# EAGLE design Regulated 4A Adjustable Circuit (EAGLE 9.6.2)
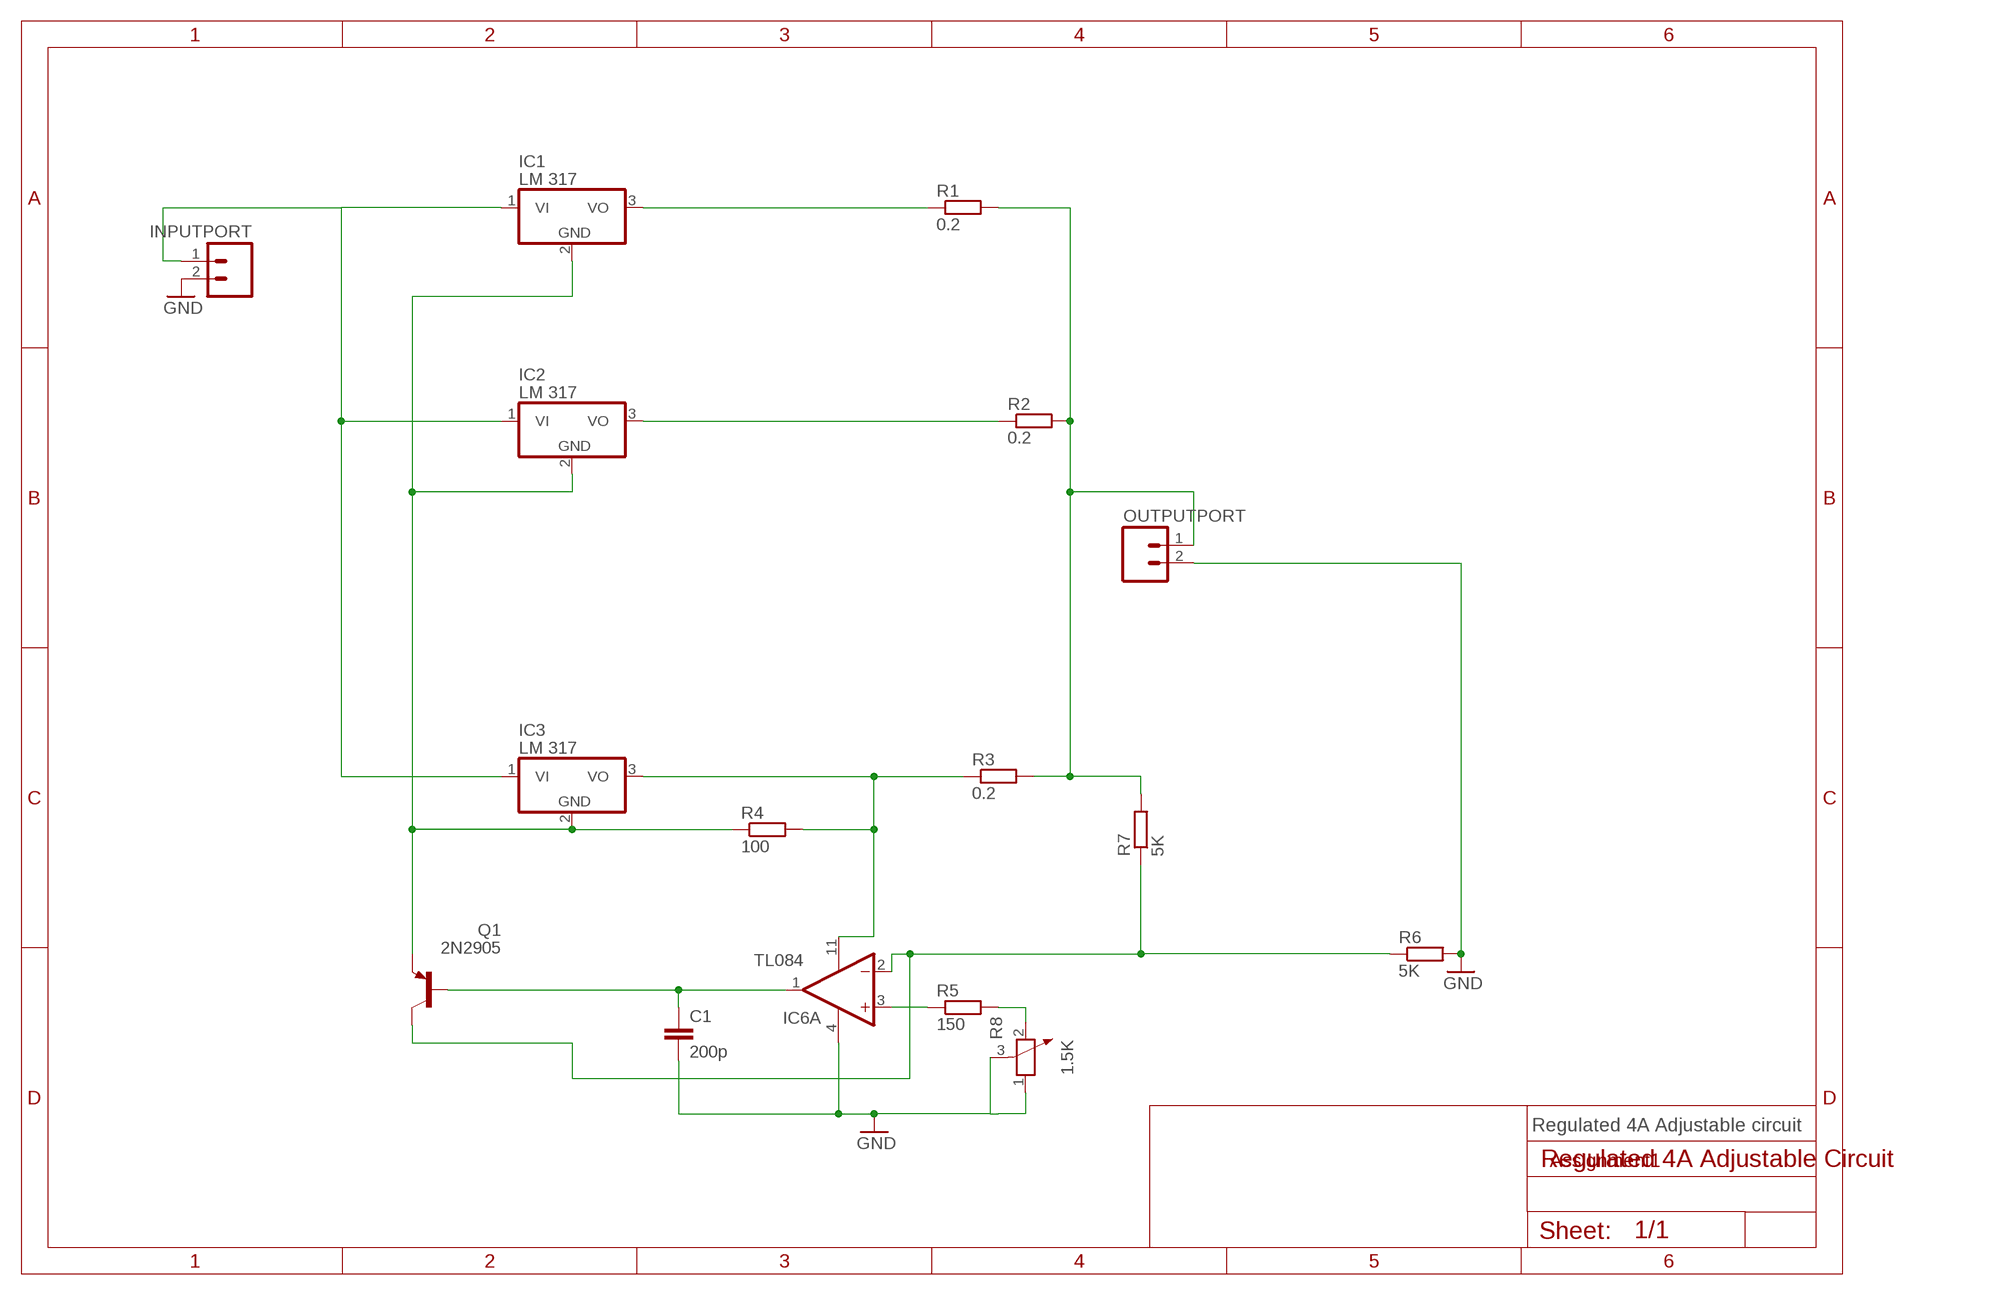
[diagram p0: schematic, sheet 1]

## Parts
C1  200p  C-EU025-025X050  [C025-025X050]
IC1  LM 317  7805TV  [TO220V]
IC2  LM 317  7805TV  [TO220V]
IC3  LM 317  7805TV  [TO220V]
IC6  TL084  MCP604P  [DIL14]
Q1  2N2905  [TO39]
R1  0.2  R-EU_0207/10  [0207/10]
R2  0.2  R-EU_0207/10  [0207/10]
R3  0.2  R-EU_0207/10  [0207/10]
R4  100  R-EU_0207/10  [0207/10]
R5  150  R-EU_0207/10  [0207/10]
R6  5K  R-EU_0207/10  [0207/10]
R7  5K  R-EU_0207/10  [0207/10]
R8  1.5K  POTENTIOMETER_PT-10  [PT-10]
SL1  INPUTPORT  M02  [02P]
SL2  OUTPUTPORT  M02  [02P]

## Nets
GND: C1.2 IC6.4(P:V+) R6.2 R8.1 R8.3 SL1.2 SL2.2
N$1: IC1.3(VO) R1.1
N$2: IC2.3(VO) R2.1
N$3: IC3.3(VO) IC6.11(P:V-) R3.1 R4.2
N$4: R1.2 R2.2 R3.2 R7.2 SL2.1
N$5: IC6.3(A:+IN) R5.1
N$6: IC6.2(A:-IN) Q1.3(C) R6.1 R7.1
N$7: R5.2 R8.2
N$8: IC1.2(GND) IC2.2(GND) IC3.2(GND) Q1.1(E) R4.1
N$9: IC1.1(VI) IC2.1(VI) IC3.1(VI) SL1.1
N$11: C1.1 IC6.1(A:OUT) Q1.2(B)
Unconnected: IC6.5(B:+IN) IC6.6(B:-IN) IC6.7(B:OUT) IC6.8(C:OUT) IC6.9(C:-IN) IC6.10(C:+IN) IC6.12(D:+IN) IC6.13(D:-IN) IC6.14(D:OUT)

## Notes on the sheet
- Regulated 4A Adjustable circuit
- Assignment1

## Library data of the parts
C1 = rcl:C-EU: CAPACITOR, European symbol; SPICEPREFIX: C
IC1-IC3 = linear:78*: Positive VOLTAGE REGULATOR Source: http://cache.national.com/ds/LM/LM78L05.pdf http://www.fairchildsemi.com/ds/LM/LM7805.pdf
IC6 = linear:MCP604: Quad Op Amp 2.7V to 6.0V Single Supply CMOS Source: http://ww1.microchip.com/downloads/en/DeviceDoc/21314g.pdf
Q1 = transistor-pnp:2N2905*: PNP Transistror
R1-R7 = rcl:R-EU_: RESISTOR, European symbol; SPICEPREFIX: R
R8 = rcl:POTENTIOMETER_: Potentiometer; SPICEMODEL: POT; SPICEPREFIX: X
SL1 SL2 = con-amp-quick:M02: AMP QUICK CONNECTOR; OC_FARNELL: unknown; OC_NEWARK: unknown

## Board
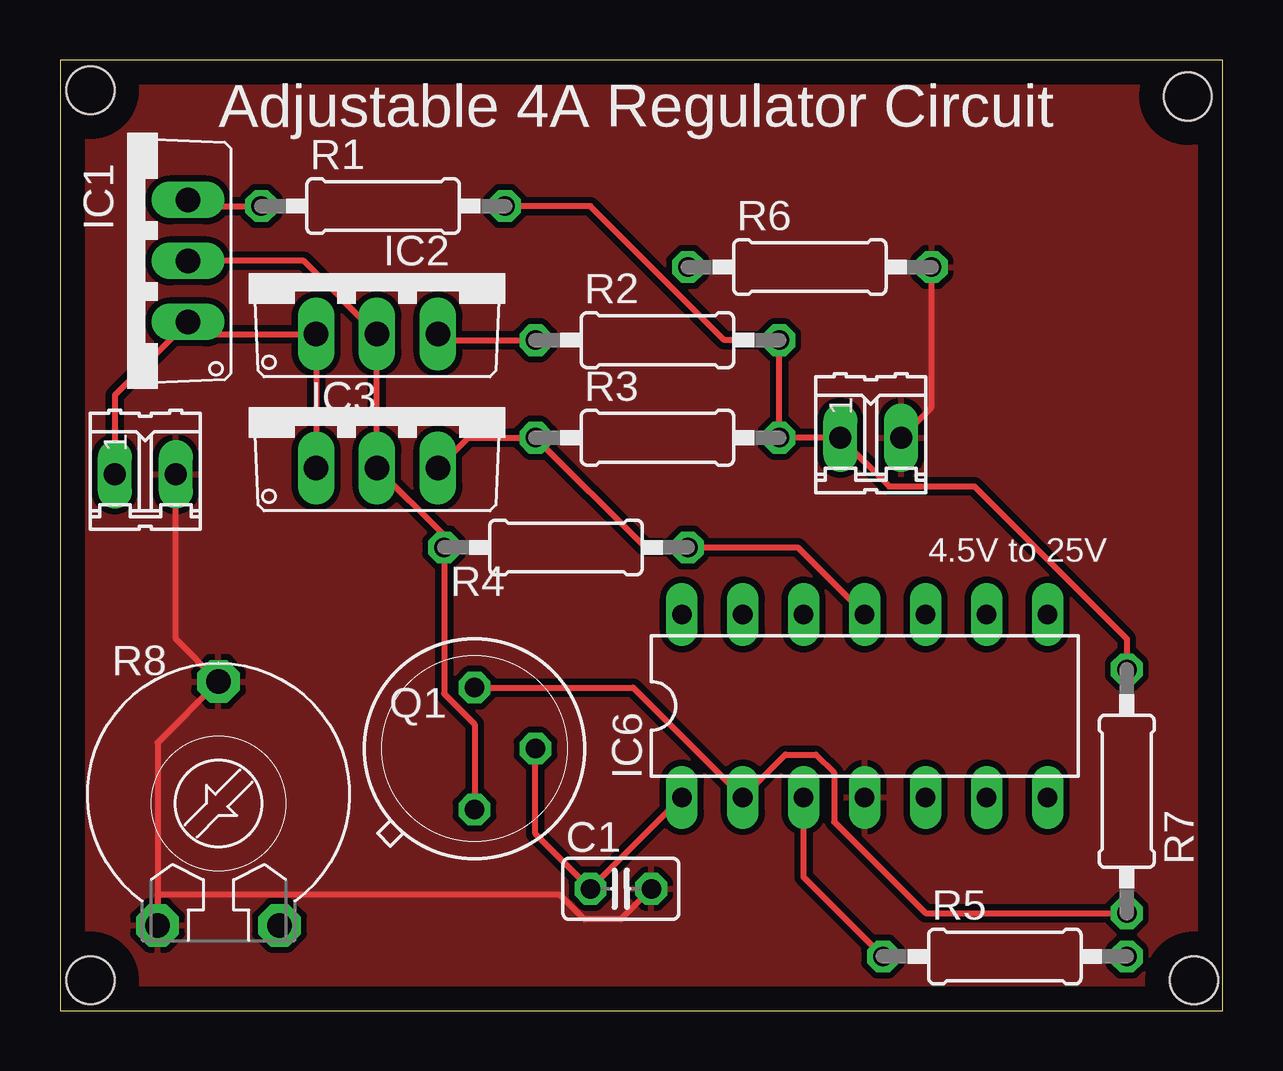
[diagram p1: board, top side]
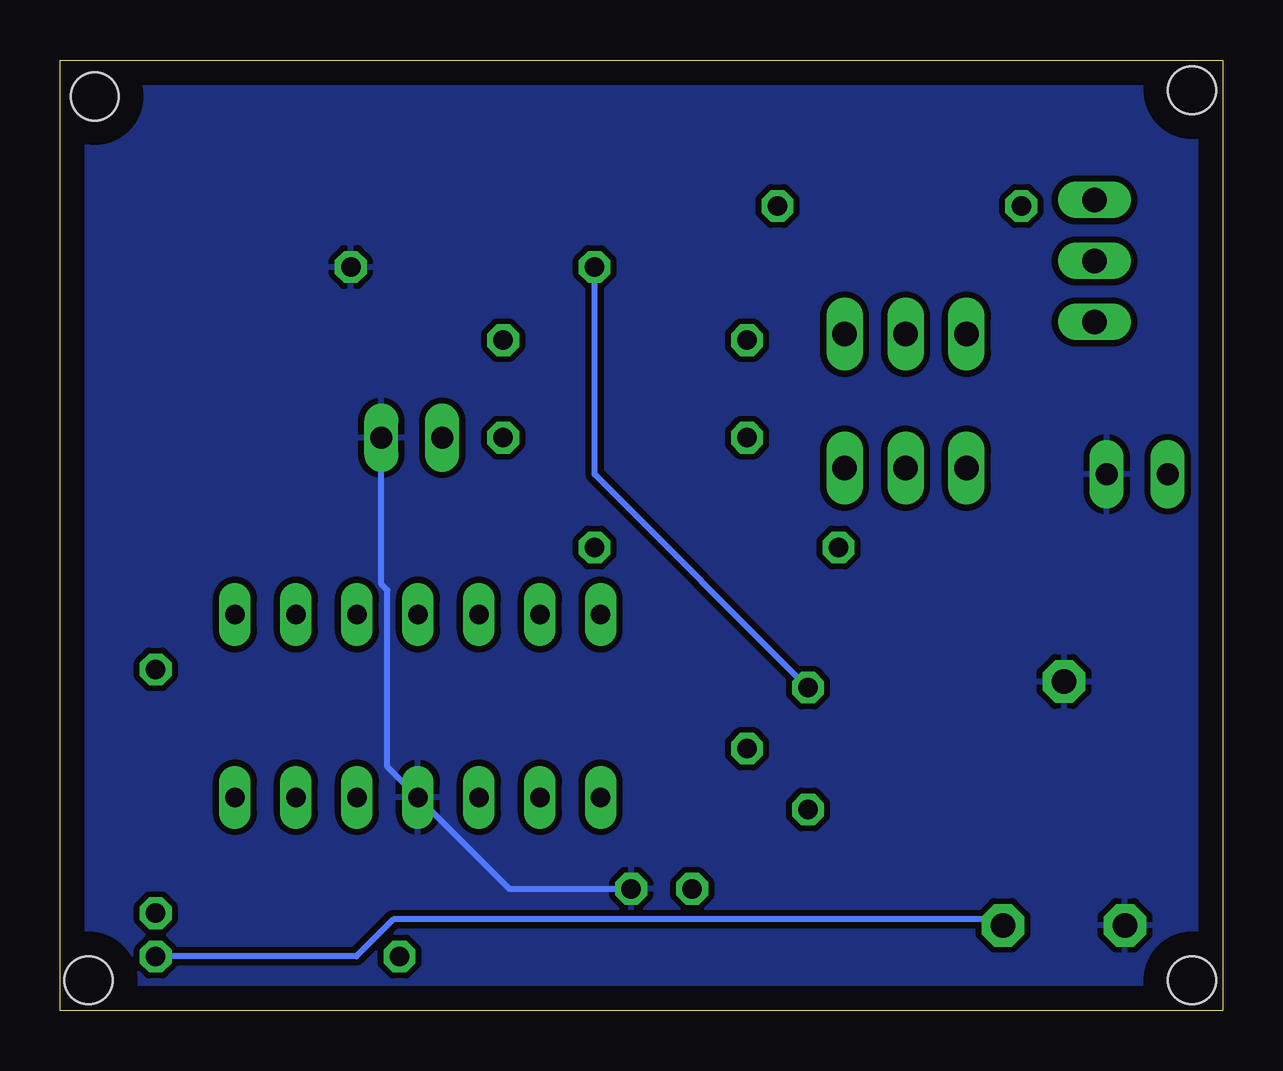
[diagram p2: board, bottom side, seen from below]

Size 48.44 x 39.61 mm. Coordinates in mm from the lower left corner, seen from the top.
Outline: 0,0 48.44,0 48.44,39.61 0,39.61 0,0
Copper layers (1*16): Top 0.035mm / dielectric 1.5mm / Bottom 0.035mm
Design rules "default *": minimum track width 10mil, minimum drill 0.35mm, track to track 10mil, track to pad 10mil, pad to pad 10mil, via to via 10mil, smd to smd 10mil, copper to edge 40mil, drill to drill 10mil, minimum pad ring 10mil, minimum via ring 8mil, stop-mask expansion 4mil, vias tented up to drill 0mil, thermal gap 10mil
Holes 2 mm at 46.99,38.1 47.24,1.27 1.27,1.27 1.27,38.35

### Footprints (pad centres in the part's own frame; a part is rotated, then mirrored left to right if it is on the bottom)
C025-025X050 = drill 0.813 octagon: 1 -1.27,0; 2 1.27,0
TO220V = drill 1.016 long: 1 -2.54,-2.54; 2 0,-2.54; 3 2.54,-2.54
DIL14 = drill 0.813 long: 1 -7.62,-3.81; 2 -5.08,-3.81; 3 -2.54,-3.81; 4 0,-3.81; 5 2.54,-3.81; 6 5.08,-3.81; 7 7.62,-3.81; 8 7.62,3.81; 9 5.08,3.81; 10 2.54,3.81; 11 0,3.81; 12 -2.54,3.81; 13 -5.08,3.81; 14 -7.62,3.81
TO39 = drill 0.813 octagon: 1 0,-2.54; 2 2.54,0; 3 0,2.54
0207/10 = drill 0.813 octagon: 1 -5.08,0; 2 5.08,0
PT-10 = drill 1.016 pad 1.778 octagon: 1 -2.54,-5.08; 2 2.54,-5.08; 3 0,5.08
02P = drill 0.914 long: 1 -1.27,0; 2 1.27,0

### Placement (x,y rotation side)
C1  23.37,5.08 0 top
IC1  2.79,31.24 90 top
IC2  13.21,30.73 0 top
IC3  13.21,25.15 0 top
IC6  33.53,12.7 0 top
Q1  17.27,10.92 0 top
R1  13.46,33.53 0 top
R2  24.89,27.94 0 top
R3  24.89,23.88 0 top
R4  21.08,19.3 0 top
R5  39.37,2.26 0 top
R6  31.24,30.99 0 top
R7  44.45,9.14 90 top
R8  6.6,8.64 0 top
SL1  3.56,22.35 0 top
SL2  33.78,23.88 0 top

### Tracks (layer width: path | path; a pad name or v marks a point on that pad's centre or on a via)
GND
  Top 0.254: SL1.2 4.83,15.49 R8.3 4.06,11.18 4.06,4.83 | 4.06,4.83 R8.1 | R6.2 36.32,25.15 SL2.2 | 4.06,4.83 20.83,4.83 21.84,3.81 23.37,3.81 C1.2
  Bottom 0.254: C1.2 29.72,5.08 IC6.4 34.8,10.16 34.8,17.53 35.05,17.78 SL2.2
  pour Top: -0.51,40.39 -0.51,-0.51 49.02,-0.51 49.02,40.13 49.02,40.64 -0.51,40.64
  pour Bottom: -1.02,41.15 49.53,41.15 49.53,-1.02 -1.02,-1.02
N$1
  Top 0.254: R1.1 5.59,33.53 IC1.3
N$2
  Top 0.254: R2.1 16,27.94 IC2.3
N$3
  Top 0.254: IC3.3 17.02,23.88 R3.1 24.38,19.3 R4.2 30.73,19.3 IC6.11
N$4
  Top 0.254: R7.2 44.45,15.49 38.1,21.84 34.54,21.84 SL2.1 R3.2 R2.2 27.69,27.94 22.1,33.53 R1.2
N$5
  Top 0.254: IC6.3 30.99,5.56 R5.1
N$6
  Top 0.254: Q1.3 23.88,13.46 IC6.2 30.23,10.67 31.5,10.67 32.26,9.91 32.26,7.87 36.07,4.06 R7.1
  Bottom 0.254: R6.1 26.16,22.35 Q1.3
N$7
  Bottom 0.254: R5.2 36.09,2.26 34.54,3.81 9.4,3.81 R8.2
N$8
  Top 0.254: Q1.1 17.27,11.94 16,13.21 R4.1 16,19.81 IC3.2 IC2.2 10.16,31.24 IC1.2
N$9
  Top 0.254: IC3.1 IC2.1 5.84,28.19 IC1.1 2.29,25.65 SL1.1
N$11
  Top 0.254: Q1.2 19.81,7.37 C1.1 IC6.1

### Text on the board
tNames: Adjustable 4A Regulator Circuit | 4.5V to 25V